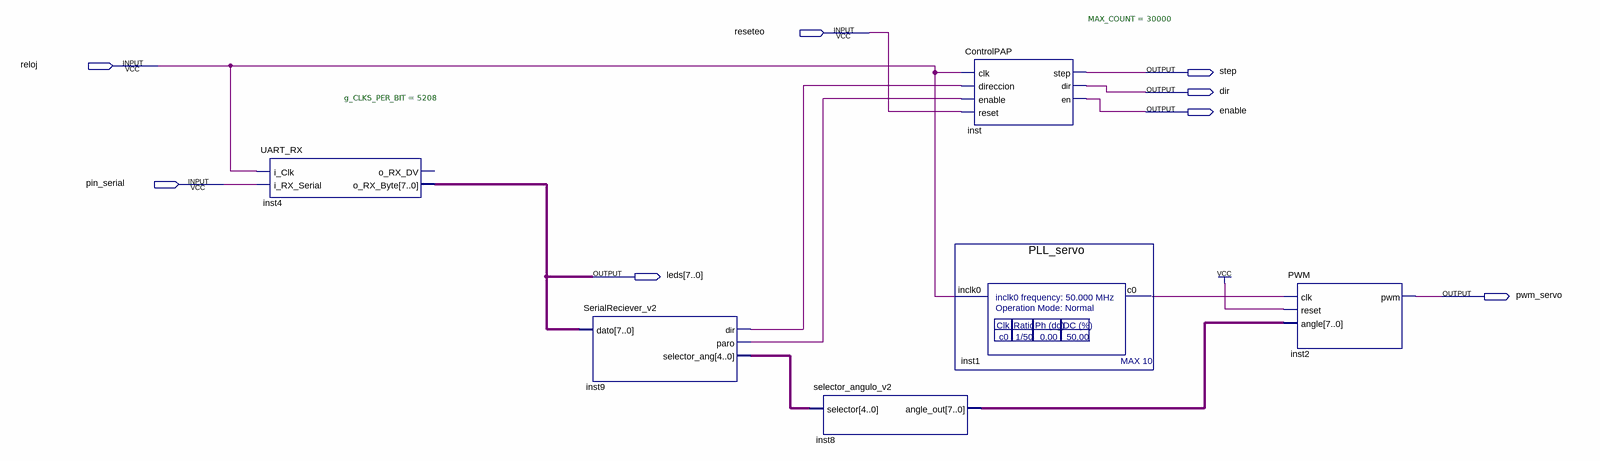
[diagram p0: schematic sheet]
// Quartus schematic GeneralControlScheme_v2.bdf as structural Verilog: 6 symbols, 8 pins
module GeneralControlScheme_v2 (
  input  reseteo,
  input  reloj,
  input  pin_serial,
  output step,
  output dir,
  output enable,
  output [7:0] leds,
  output pwm_servo
);

  wire inst1_c0, inst9_dir, inst9_paro;
  wire [4:0] inst9_selector_ang;
  wire [7:0] inst8_angle_out;

  UART_RX #(.g_CLKS_PER_BIT(5208)) inst4 (.i_Clk(reloj), .i_RX_Serial(pin_serial), .o_RX_Byte(leds));  // open: o_RX_DV
  SerialReciever_v2 inst9 (.dato(leds), .dir(inst9_dir), .paro(inst9_paro), .selector_ang(inst9_selector_ang));
  selector_angulo_v2 inst8 (.selector(inst9_selector_ang), .angle_out(inst8_angle_out));
  ControlPAP #(.MAX_COUNT(30000)) inst (
    .clk(reloj), .direccion(inst9_dir), .enable(inst9_paro), .reset(reseteo), .step(step), .dir(dir),
    .en(enable));
  PLL_servo inst1 (.inclk0(reloj), .c0(inst1_c0));
  PWM inst2 (.clk(inst1_c0), .reset(1'b1), .angle(inst8_angle_out), .pwm(pwm_servo));
endmodule
